# Altium schematic sheet Speaker Driver.SchDoc
size A4; SheetNumber: 3; SheetTotal: 3
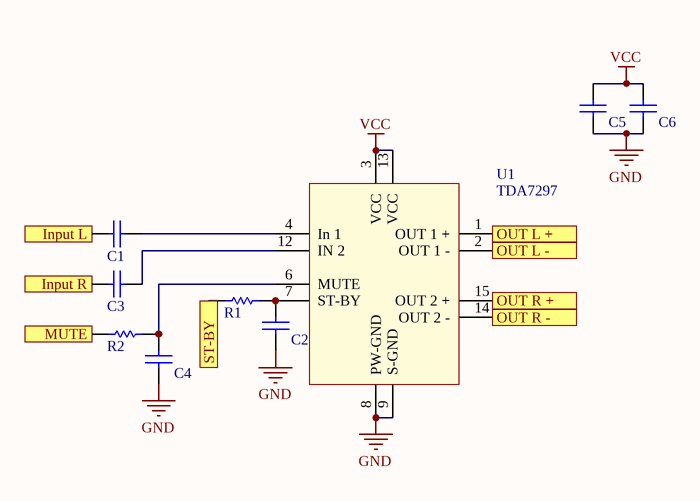
[diagram p0: Speaker Driver.SchDoc]

## Parts
C1  1206GC102KAT1A  [AVX-1206-2_L]  (value not drawn)
C2  1206GC102KAT1A  [AVX-1206-2_L]  (value not drawn)
C3  1206GC102KAT1A  [AVX-1206-2_L]  (value not drawn)
C4  1206GC102KAT1A  [AVX-1206-2_L]  (value not drawn)
C5  1206GC102KAT1A  [AVX-1206-2_L]  (value not drawn)
C6  1206GC102KAT1A  [AVX-1206-2_L]  (value not drawn)
R1  ERJ-8GEY0R00V  [RESC3216X70X50NL05T20]  (value not drawn)
R2  ERJ-8GEY0R00V  [RESC3216X70X50NL05T20]  (value not drawn)
U1  TDA7297  [TDA7297]

## Ports
Input L (in), Input R (in), MUTE (in), OUT L + (out), OUT L - (out), OUT R + (out), OUT R - (out), ST-BY (in)

## Nets
GND: C2.2 C4.2 C5.2 C6.2 U1.8(PW-GND) U1.9(S-GND)
VCC: C5.1 C6.1 U1.3(VCC) U1.13(VCC)
Input L: C1.2 ; port Input L
Input R: C3.2 ; port Input R
MUTE: R2.1 ; port MUTE
OUT L +: U1.1(OUT_1_+) ; port OUT L +
OUT L -: U1.2(OUT_1_-) ; port OUT L -
OUT R +: U1.15(OUT_2_+) ; port OUT R +
OUT R -: U1.14(OUT_2_-) ; port OUT R -
ST-BY: R1.1 ; port ST-BY
NetC1_1: C1.1 U1.4(In_1)
NetC2_1: C2.1 R1.2 U1.7(ST-BY)
NetC3_1: C3.1 U1.12(IN_2)
NetC4_1: C4.1 R2.2 U1.6(MUTE)

## Library data of the parts
C1-C6 = CMP-2000-05468-1: Chip Capacitor, 1 nF, +/- 10%, -55 to 125 degC, 1206 (3216 Metric), RoHS, Tape and Reel; Manufacturer: AVX; Capacitance: 0.001uF; Dielectric: X7R; Voltage Rating DC: 2000V; Package Reference: 1206; Datasheet Version: 11/2010; Mounting Technology: SurfaceMount; Manufacturer URL: http://www.avx.com/; Tolerance: 10%; Tolerance (%): ±10%; PartNumber: 1206GC102KAT1A; Datasheet URL: https://datasheet.ciiva.com/11787/0900766b80ed4c37-11787781.pdf; Package Description: 2-Pin SMD, Body 3.4 x 1.8 mm; Case Size/Dimension: 1206; Rated Voltage: 2000V
R1 R2 = CMP-2003-00541-1: Manufacturer: Panasonic; Part Number: ERJ-8GEY0R00V